# EAGLE schematic RFM-XXXXS Module (EAGLE 6.3)
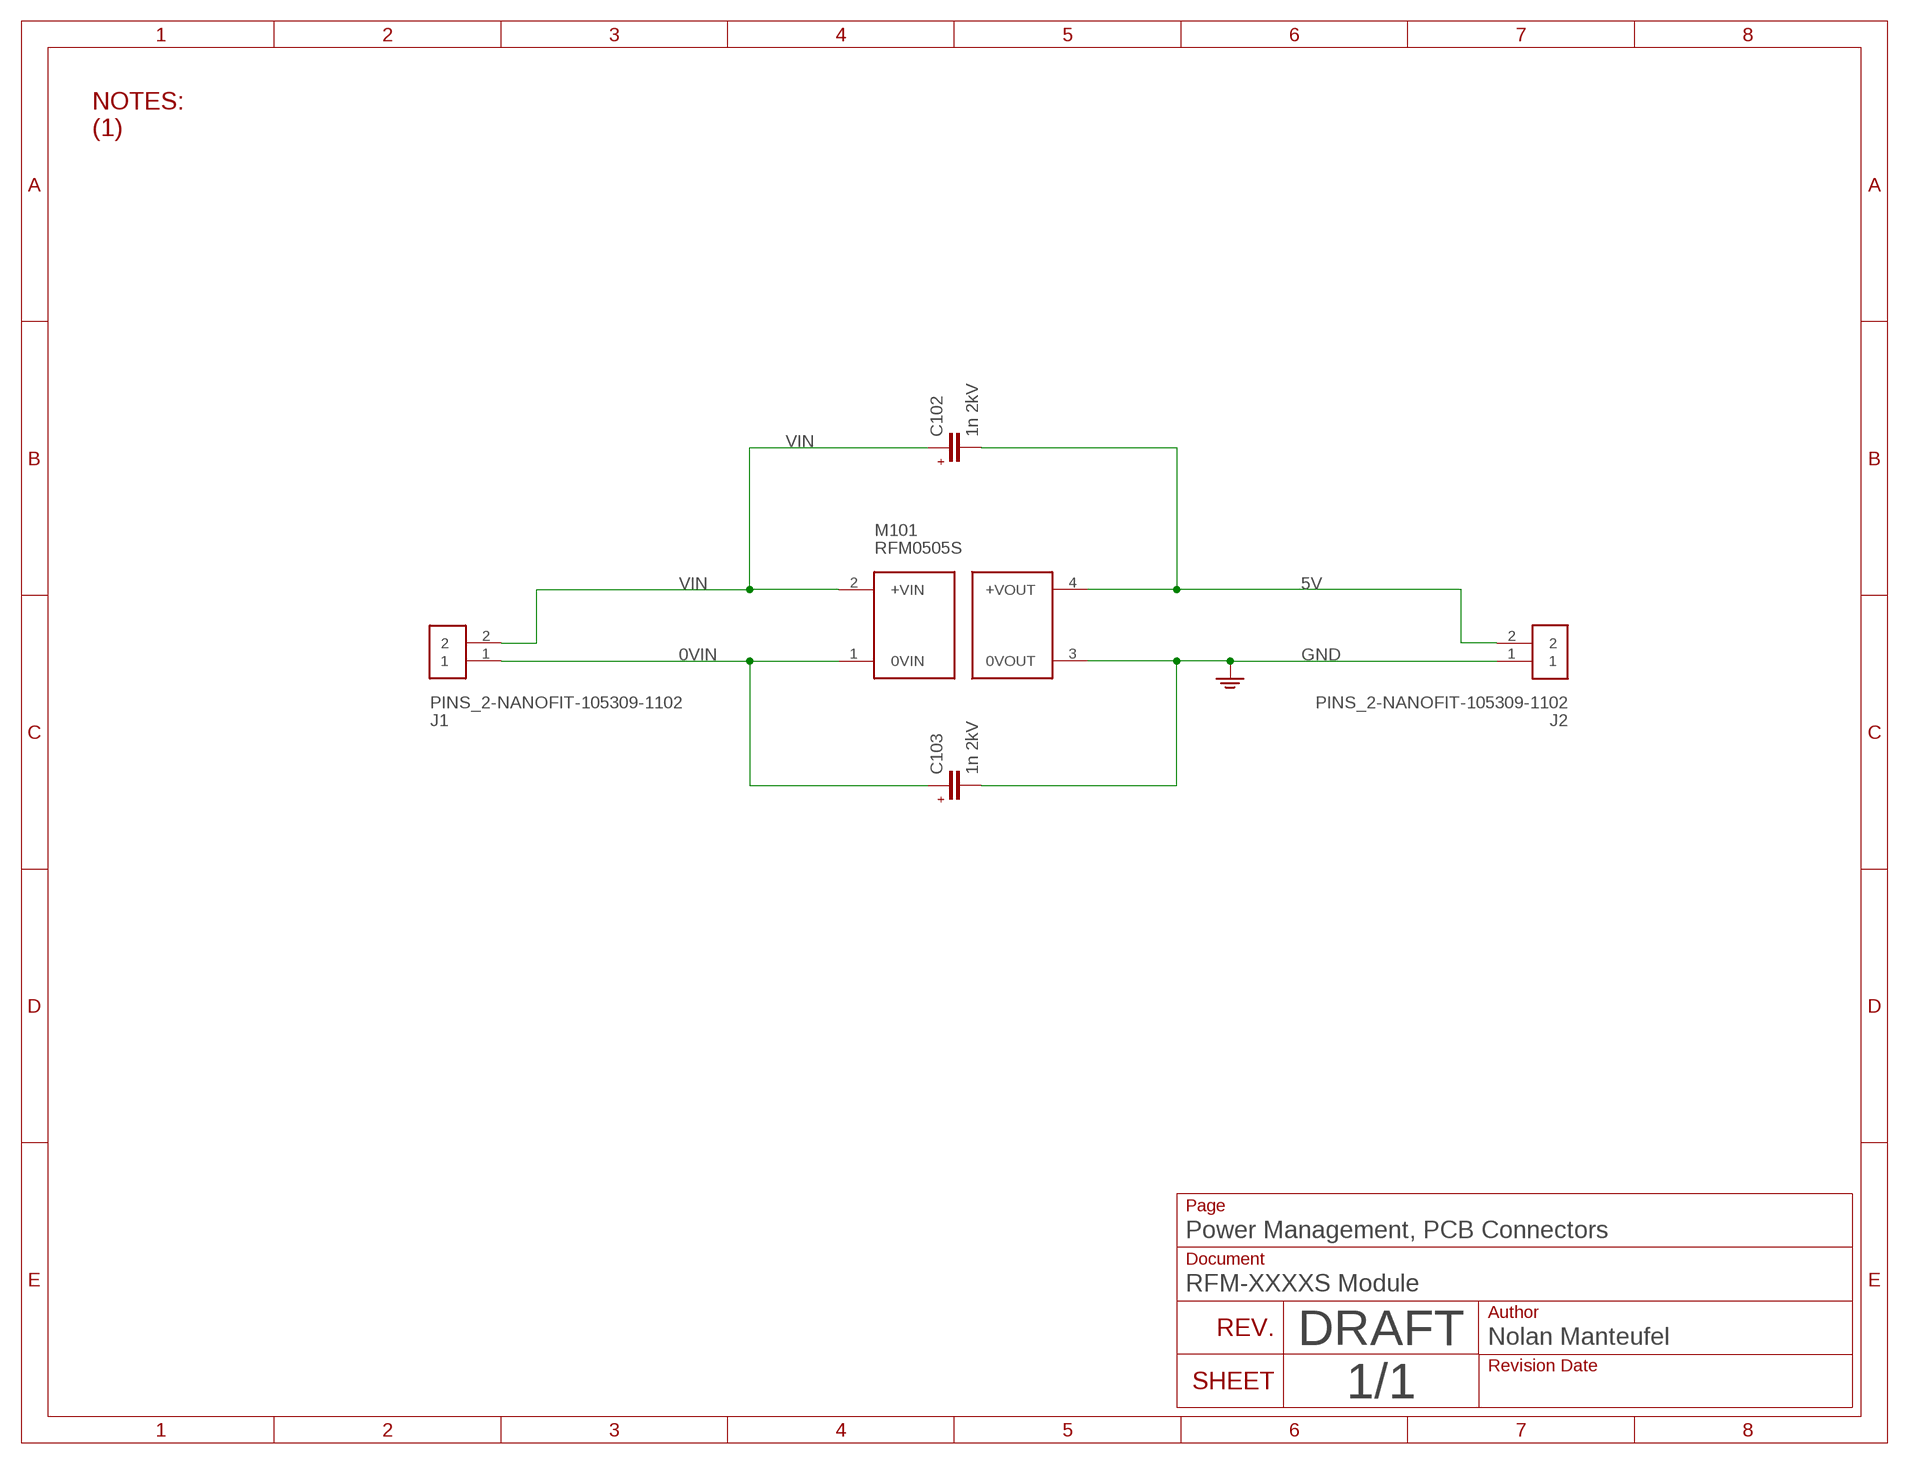
[diagram p0: schematic, sheet 1]

## Parts
C102  1n 2kV  COVAL  [C050-024X044]
C103  1n 2kV  COVAL  [C050-024X044]
J1  PINS_2-NANOFIT-105309-1102  [PINS_2-NANOFIT]
J2  PINS_2-NANOFIT-105309-1102  [PINS_2-NANOFIT]
M101  RFM0505S  DCDC_ISOLATORRFM-XXXXS  [RFM-XXXXS]

## Nets
0VIN: C103.2(+) J1.1 M101.1(0VIN)
5V: C102.1(-) J2.2 M101.4(+VOUT)
GND: C103.1(-) J2.1 M101.3(0VOUT)
VIN: C102.2(+) J1.2 M101.2(+VIN)

## Notes on the sheet
- NOTES:
  (1)
- Page
- Power Management, PCB Connectors
- Document
- REV. | Author
- DRAFT
- Nolan Manteufel
- SHEET | Revision Date

## Library data of the parts
C102 C103 = nolan-utsa:C
J1 J2 = nolan-utsa:PINS_2
M101 = nolan-utsa:DCDC_ISOLATOR